# Altium project Transmitter - Student Version.PrjPcb
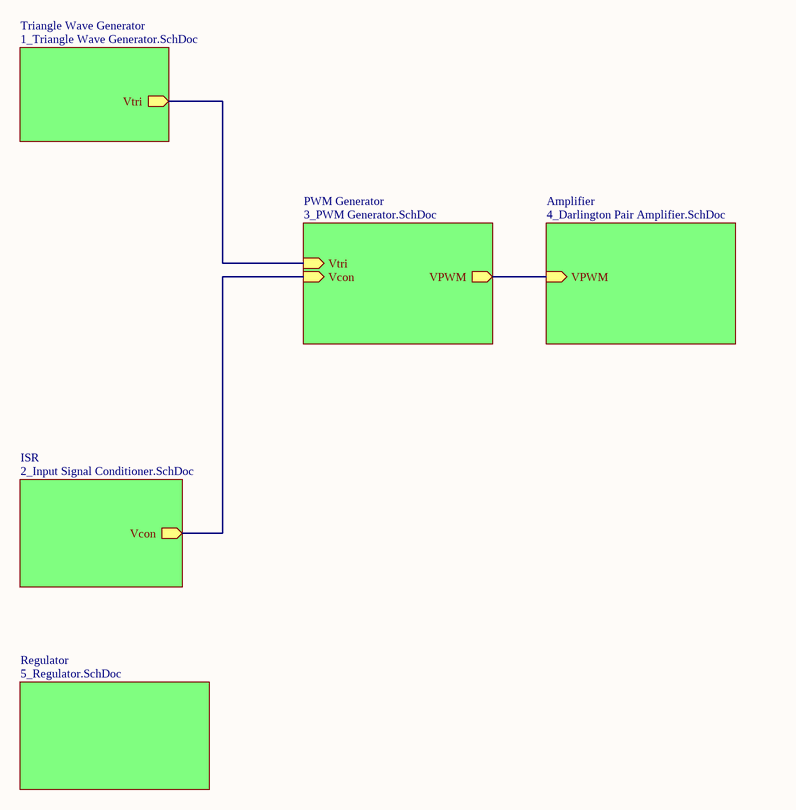
[diagram p0: Transmitter.SchDoc]
6 sheets, 50 parts. Net scope: hierarchical (ports join the sheet entries above them; power ports are global).
Board file: Transmitter.PcbDoc
Sheets:
  Transmitter.SchDoc
    Triangle Wave Generator = 1_Triangle Wave Generator.SchDoc
    ISR = 2_Input Signal Conditioner.SchDoc
    PWM Generator = 3_PWM Generator.SchDoc
    Amplifier = 4_Darlington Pair Amplifier.SchDoc
    Regulator = 5_Regulator.SchDoc

## Sheet Transmitter.SchDoc
size A4; SheetNumber: 1; SheetTotal: 8

### Sub-sheets
Amplifier = 4_Darlington Pair Amplifier.SchDoc: VPWM (in)
ISR = 2_Input Signal Conditioner.SchDoc: Vcon (out)
PWM Generator = 3_PWM Generator.SchDoc: Vcon (in), Vtri (in), VPWM (out)
Regulator = 5_Regulator.SchDoc: no entries
Triangle Wave Generator = 1_Triangle Wave Generator.SchDoc: Vtri (out)

### Nets
NetC7_2: sheet Triangle Wave Generator/Vtri, sheet PWM Generator/Vtri
NetQ1_2: sheet PWM Generator/VPWM, sheet Amplifier/VPWM
NetR16_1: sheet ISR/Vcon, sheet PWM Generator/Vcon

## Sheet 1_Triangle Wave Generator.SchDoc
size A4; SheetNumber: 2; SheetTotal: 6
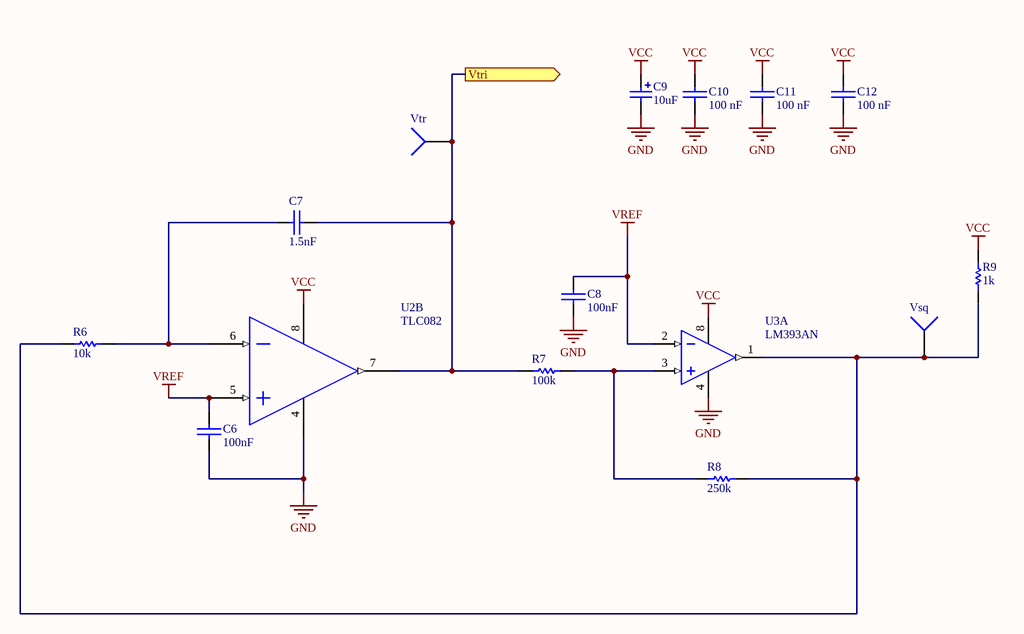
[diagram p1: 1_Triangle Wave Generator.SchDoc]

### Parts
C6  100nF  [ece-RAD0.2]
C7  1.5nF  [ece-RAD0.2]
C8  100nF  [ece-RAD0.2]
C9  10uF  [ece-CAPAD2TH0.3]
C10  100 nF  [ece-RAD0.2]
C11  100 nF  [ece-RAD0.2]
C12  100 nF  [ece-RAD0.2]
R6  10k  [ece-AXIAL0.4]
R7  100k  [ece-AXIAL0.4]
R8  250k  [ece-AXIAL0.4]
R9  1k  [ece-AXIAL0.4]
U2  TLC082  [ECE-DIP8]  (part B of 2)
U3  LM393AN  [ECE-DIP8]  (part A of 2)
Vsq  GND  [ece-HDR1]  (value not drawn)
Vtr  GND  [ece-HDR1]  (value not drawn)

### Ports
Vtri (out)

### Nets
GND: C6.1 C8.1 C9.2 C10.2 C11.2 C12.2 U2.4(GND) U3.4(GND)
VCC: C9.1 C10.1 C11.1 C12.1 R9.2 U2.8(V(+)) U3.8(V+)
VREF: C6.2 C8.2 U2.5(IN2(+)) U3.2(IN-)
NetC7_1: C7.1 R6.2 U2.6(IN2(-))
NetC7_2: C7.2 R7.1 U2.7(OUT2) Vtr.1 ; port Vtri
NetR6_1: R6.1 R8.2 R9.1 U3.1(OUT) Vsq.1
NetR7_2: R7.2 R8.1 U3.3(IN+)

### Library data of the parts
C6-C8 C10-C12 = CAP: Capacitor Non Polarised Through Hole
  C6 C8: Value: 100nF
  C7: Value: 1.5nF
  C10-C12: Value: 100 nF
C9 = CAP 22uF TH: Polarized Capacitor (Radial); Manufacturer: Generic Components; Class I: Passive; Published: 8-Jun-2000; Revision: July-2002: Re-released for DXP Platform.; Publisher: Altium Limited; Class II: Capacitor; Value: 10uF
R6-R9 = Res1: Resistor; Published: 8-Jun-2000; LatestRevisionDate: 17-Jul-2002; LatestRevisionNote: Re-released for DXP Platform.; PackageReference: AXIAL-0.3; Publisher: Altium Limited
  R6: Value: 10k
  R7: Value: 100k
  R8: Value: 250k
  R9: Value: 1k
U3 = LM393AN: Dual Comparator; Published: 17-Jul-2002; LatestRevisionDate: 06-Jun-2005; LatestRevisionNote: Stylized 3D Model Added.; DatasheetVersion: 1988; PackageReference: 626-05; Publisher: Altium Limited; PackageDescription: DIP; 8 Leads; Row Spacing 7.62 mm; Pitch 2.54 mm; ComponentLink1Description: Manufacturer Link; ComponentLink1URL: http://www.onsemi.com/site/products/taxonomy/0,4438,133,00.html
Vsq Vtr = Test pin: Socket; LatestRevisionDate: 17-Jul-2002; LatestRevisionNote: Re-released for DXP Platform.; Publisher: Altium Limited
U2 = TLC082: Value: TLC082

## Sheet 2_Input Signal Conditioner.SchDoc
size A4; SheetNumber: 3; SheetTotal: 6
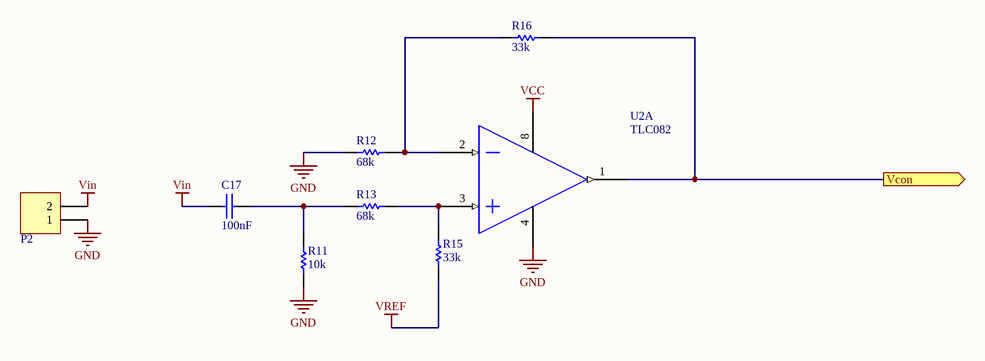
[diagram p2: 2_Input Signal Conditioner.SchDoc]

### Parts
C17  100nF  [ece-RAD0.2]
P2  Header 2  [ece-TER2-10MM]  (value not drawn)
R11  10k  [ece-AXIAL0.4]
R12  68k  [ece-AXIAL0.4]
R13  68k  [ece-AXIAL0.4]
R15  33k  [ece-AXIAL0.4]
R16  33k  [ece-AXIAL0.4]
U2  TLC082  [ECE-DIP8]  (part A of 2)

### Ports
Vcon (out)

### Nets
GND: P2.1 R11.1 R12.2 U2.4(GND)
VCC: U2.8(V(+))
Vin: C17.1 P2.2
VREF: R15.1
NetC17_2: C17.2 R11.2 R13.2
NetR12_1: R12.1 R16.2 U2.2(IN1(-))
NetR13_1: R13.1 R15.2 U2.3(IN1(+))
NetR16_1: R16.1 U2.1(OUT1) ; port Vcon

### Library data of the parts
C17 = CAP: Capacitor Non Polarised Through Hole; Value: 100nF
P2 = TERMINAL 2: Large 2 way screw connector
R11-R13 R15 R16 = Res1: Resistor; Published: 8-Jun-2000; LatestRevisionDate: 17-Jul-2002; LatestRevisionNote: Re-released for DXP Platform.; PackageReference: AXIAL-0.3; Publisher: Altium Limited
  R11: Value: 10k
  R12 R13: Value: 68k
  R15 R16: Value: 33k
U2 = TLC082: Value: TLC082

## Sheet 3_PWM Generator.SchDoc
size A4; SheetNumber: 4; SheetTotal: 6
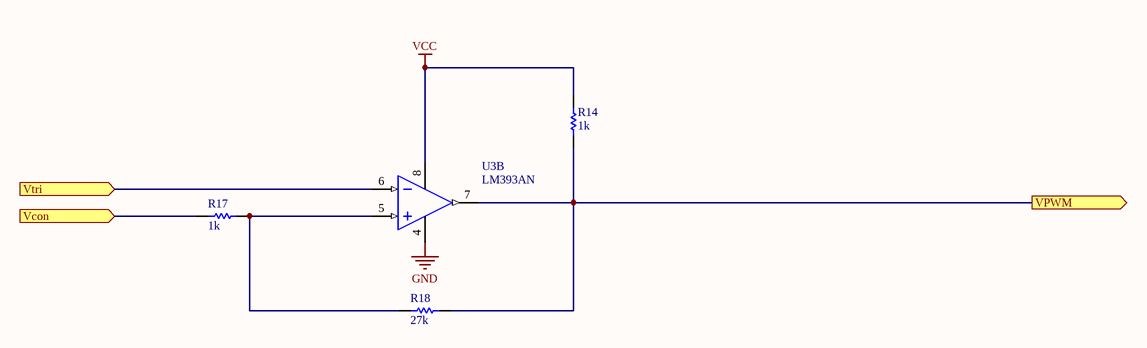
[diagram p3: 3_PWM Generator.SchDoc]

### Parts
R14  1k  [ece-AXIAL0.4]
R17  1k  [ece-AXIAL0.4]
R18  27k  [ece-AXIAL0.4]
U3  LM393AN  [ECE-DIP8]  (part B of 2)

### Ports
Vcon (in), VPWM (out), Vtri (in)

### Nets
GND: U3.4(GND)
VCC: R14.1 U3.8(V+)
NetC7_2: U3.6(IN-) ; port Vtri
NetQ1_2: R14.2 R18.1 U3.7(OUT) ; port VPWM
NetR16_1: R17.2 ; port Vcon
NetR17_1: R17.1 R18.2 U3.5(IN+)

### Library data of the parts
R14 R17 R18 = Res1: Resistor; Published: 8-Jun-2000; LatestRevisionDate: 17-Jul-2002; LatestRevisionNote: Re-released for DXP Platform.; PackageReference: AXIAL-0.3; Publisher: Altium Limited
  R14 R17: Value: 1k
  R18: Value: 27k
U3 = LM393AN: Dual Comparator; Published: 17-Jul-2002; LatestRevisionDate: 06-Jun-2005; LatestRevisionNote: Stylized 3D Model Added.; DatasheetVersion: 1988; PackageReference: 626-05; Publisher: Altium Limited; PackageDescription: DIP; 8 Leads; Row Spacing 7.62 mm; Pitch 2.54 mm; ComponentLink1Description: Manufacturer Link; ComponentLink1URL: http://www.onsemi.com/site/products/taxonomy/0,4438,133,00.html

## Sheet 4_Darlington Pair Amplifier.SchDoc
size A4; SheetNumber: 5; SheetTotal: 6
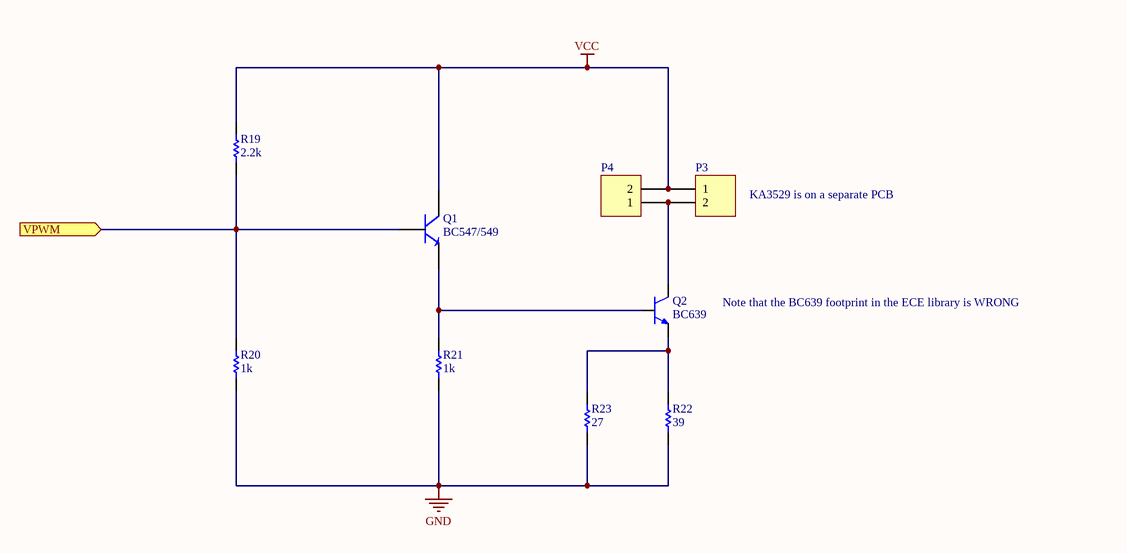
[diagram p4: 4_Darlington Pair Amplifier.SchDoc]

### Parts
P3  Header 2  [ece-HDR1X2]  (value not drawn)
P4  Header 2  [ece-HDR1X2]  (value not drawn)
Q1  BC547/549  [ece-TO-92Z]
Q2  BC639  [TO92]
R19  2.2k  [ece-AXIAL0.4]
R20  1k  [ece-AXIAL0.4]
R21  1k  [ece-AXIAL0.4]
R22  39  [ece-AXIAL0.4]
R23  27  [ece-AXIAL0.4]

### Ports
VPWM (in)

### Nets
GND: R20.2 R21.2 R22.2 R23.2
VCC: P3.1 P4.2 Q1.1(C) R19.1
NetP3_2: P3.2 P4.1 Q2.2
NetQ1_2: Q1.2(B) R19.2 R20.1 ; port VPWM
NetQ1_3: Q1.3(E) Q2.3 R21.1
NetQ2_1: Q2.1 R22.1 R23.1

### Notes on the sheet
- KA3529 is on a separate PCB
- Note that the BC639 footprint in the ECE library is WRONG

### Library data of the parts
P3 P4 = Header 2: Header, 2-Pin; LatestRevisionDate: 17-Jul-2002; LatestRevisionNote: Re-released for DXP Platform.; Publisher: Altium Limited
Q1 = BC547/549: NPN Transistor; Value: BC547/549
Q2 = BC639: BC639 with correct footprint
R19-R23 = Res1: Resistor; Published: 8-Jun-2000; LatestRevisionDate: 17-Jul-2002; LatestRevisionNote: Re-released for DXP Platform.; PackageReference: AXIAL-0.3; Publisher: Altium Limited
  R19: Value: 2.2k
  R20 R21: Value: 1k
  R22: Value: 39
  R23: Value: 27

## Sheet 5_Regulator.SchDoc
size A4; SheetNumber: 6; SheetTotal: 6
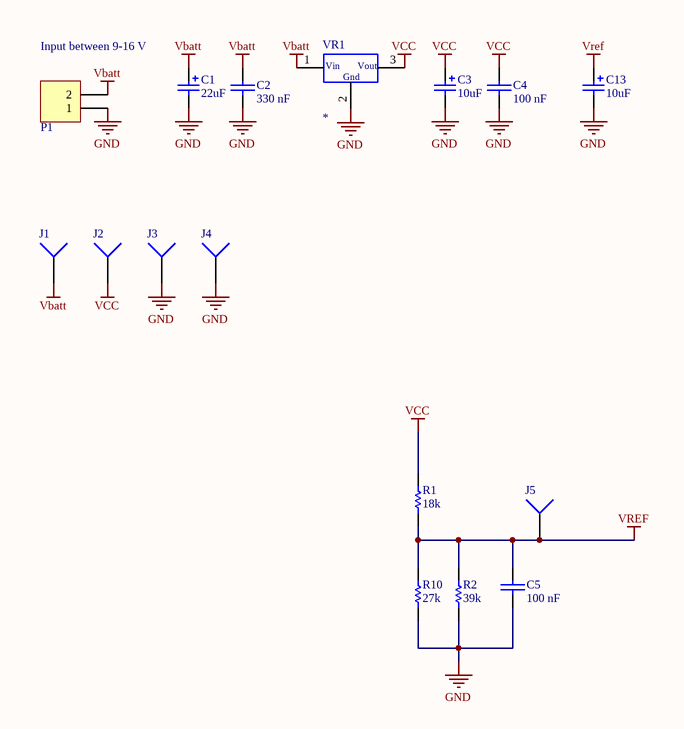
[diagram p5: 5_Regulator.SchDoc]

### Parts
C1  22uF  [ece-CAPAD2TH0.3]
C2  330 nF  [ece-RAD0.2]
C3  10uF  [ece-CAPAD2TH0.3]
C4  100 nF  [ece-RAD0.2]
C5  100 nF  [ece-RAD0.2]
C13  10uF  [ece-CAPAD2TH0.3]
J1  Vbatt  [ece-HDR1]  (value not drawn)
J2  Vcc  [ece-HDR1]  (value not drawn)
J3  GND  [ece-HDR1]  (value not drawn)
J4  GND  [ece-HDR1]  (value not drawn)
J5  Vcc/2  [ece-HDR1]  (value not drawn)
P1  Header 2  [ece-TER2-10MM]  (value not drawn)
R1  18k  [ece-AXIAL0.4]
R2  39k  [ece-AXIAL0.4]
R10  27k  [ece-AXIAL0.4]
VR1  *  [ece-TO220]

### Nets
GND: C1.2 C2.2 C3.2 C4.2 C5.2 C13.2 J3.1 J4.1 P1.1 R2.1 R10.1 VR1.2(Gnd)
Vbatt: C1.1 C2.1 J1.1 P1.2 VR1.1(Vin)
VCC: C3.1 C4.1 J2.1 R1.2 VR1.3(Vout)
VREF: C5.1 C13.1 J5.1 R1.1 R2.2 R10.2

### Notes on the sheet
- Input between 9-16 V

### Library data of the parts
C1 C3 C13 = CAP 22uF TH: as C9 on sheet 1_Triangle Wave Generator; Published: 8-Jun-2000; Revision: July-2002: Re-released for DXP Platform.; Publisher: Altium Limited; Class II: Capacitor
  C1: Value: 22uF
  C3 C13: Value: 10uF
C2 C4 C5 = CAP: Capacitor Non Polarised Through Hole
  C2: Value: 330 nF
  C4 C5: Value: 100 nF
J1-J5 = Test pin: Socket; LatestRevisionDate: 17-Jul-2002; LatestRevisionNote: Re-released for DXP Platform.; Publisher: Altium Limited
P1 = TERMINAL 2: Large 2 way screw connector
R1 R2 R10 = Res1: Resistor; Published: 8-Jun-2000; LatestRevisionDate: 17-Jul-2002; LatestRevisionNote: Re-released for DXP Platform.; PackageReference: AXIAL-0.3; Publisher: Altium Limited
  R1: Value: 18k
  R2: Value: 39k
  R10: Value: 27k
VR1 = VoltRegBig: Voltage Regulator; Value: *

## Nets that join several sheets
GND: 1_Triangle Wave Generator (8 pins), 2_Input Signal Conditioner (P2.1 R11.1 R12.2 U2.4), 3_PWM Generator (U3.4), 4_Darlington Pair Amplifier (R20.2 R21.2 R22.2 R23.2), 5_Regulator (12 pins)
VCC: 1_Triangle Wave Generator (7 pins), 2_Input Signal Conditioner (U2.8), 3_PWM Generator (R14.1 U3.8), 4_Darlington Pair Amplifier (P3.1 P4.2 Q1.1 R19.1), 5_Regulator (5 pins)
VREF: 1_Triangle Wave Generator (C6.2 C8.2 U2.5 U3.2), 2_Input Signal Conditioner (R15.1), 5_Regulator (6 pins)
NetC7_2: 1_Triangle Wave Generator (C7.2 R7.1 U2.7 Vtr.1), 3_PWM Generator (U3.6)
NetQ1_2: 3_PWM Generator (R14.2 R18.1 U3.7), 4_Darlington Pair Amplifier (Q1.2 R19.2 R20.1)
NetR16_1: 2_Input Signal Conditioner (R16.1 U2.1), 3_PWM Generator (R17.2)